# Altium schematic sheet Stimulation Stage.SchDoc
size E; SheetNumber: 1; SheetTotal: 1
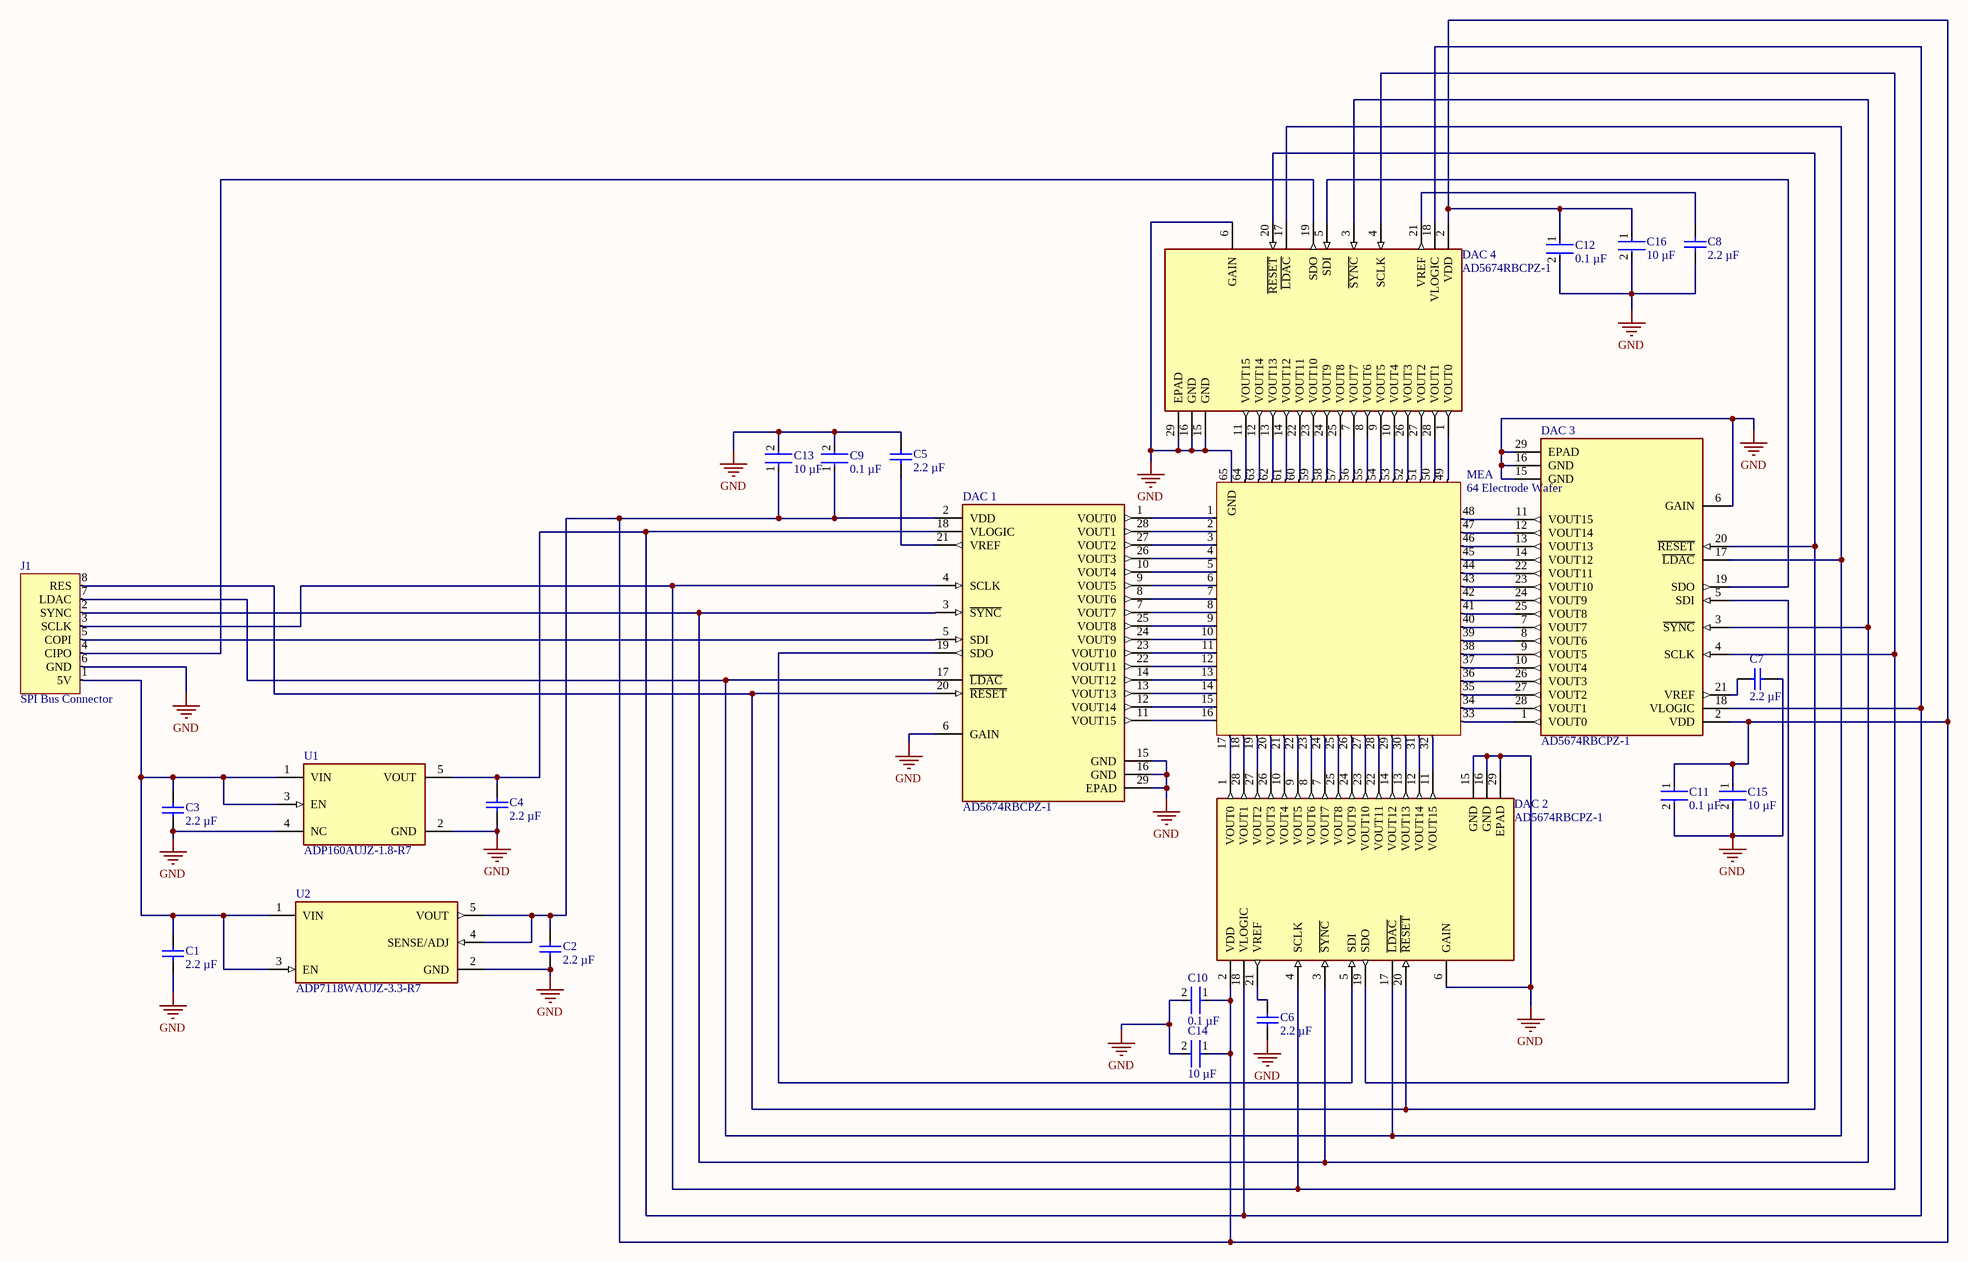
[diagram p0: Stimulation Stage.SchDoc]

## Parts
C1  2.2 µF  [CAPC1608X90X30LL10T20]
C2  2.2 µF  [CAPC1608X90X30LL10T20]
C3  2.2 µF  [CAPC1608X90X30LL10T20]
C4  2.2 µF  [CAPC1608X90X30LL10T20]
C5  2.2 µF  [CAPC1608X90X30LL10T20]
C6  2.2 µF  [CAPC1608X90X30LL10T20]
C7  2.2 µF  [CAPC1608X90X30LL10T20]
C8  2.2 µF  [CAPC1608X90X30LL10T20]
C9  0.1 µF  [FP-CL278-IPC_C]
C10  0.1 µF  [FP-CL278-IPC_C]
C11  0.1 µF  [FP-CL278-IPC_C]
C12  0.1 µF  [FP-CL278-IPC_C]
C13  10 µF  [FP-CL10-IPC_C]
C14  10 µF  [FP-CL10-IPC_C]
C15  10 µF  [FP-CL10-IPC_C]
C16  10 µF  [FP-CL10-IPC_C]
DAC_1  AD5674RBCPZ-1  [FP-CP-28-9-IPC_C]
DAC_2  AD5674RBCPZ-1  [FP-CP-28-9-IPC_C]
DAC_3  AD5674RBCPZ-1  [FP-CP-28-9-IPC_C]
DAC_4  AD5674RBCPZ-1  [FP-CP-28-9-IPC_C]
J1  SPI Bus Connector  [SPI Bus Connector]
MEA  64 Electrode Wafer  [64 Electrode Wafer Footprint]
U1  ADP160AUJZ-1.8-R7  [FP-UJ-5-IPC_C]
U2  ADP7118WAUJZ-3.3-R7  [FP-UJ-5-IPC_C]

## Nets
GND: C1.1 C2.1 C3.1 C4.1 C5.2 C6.1 C7.1 C8.1 C9.2 C10.2 C11.2 C12.2 C13.2 C14.2 C15.2 C16.2 DAC_1.6(GAIN) DAC_1.15(GND) DAC_1.16(GND) DAC_1.29(EPAD) DAC_2.6(GAIN) DAC_2.15(GND) DAC_2.16(GND) DAC_2.29(EPAD) DAC_3.6(GAIN) DAC_3.15(GND) DAC_3.16(GND) DAC_3.29(EPAD) DAC_4.6(GAIN) DAC_4.15(GND) DAC_4.16(GND) DAC_4.29(EPAD) J1.6(GND) MEA.65(GND) U1.2(GND) U1.4(NC) U2.2(GND)
NetC1_2: C1.2 C3.2 J1.1(5V) U1.1(VIN) U1.3(EN) U2.1(VIN) U2.3(EN)
NetC2_2: C2.2 C9.1 C10.1 C11.1 C12.1 C13.1 C14.1 C15.1 C16.1 DAC_1.2(VDD) DAC_2.2(VDD) DAC_3.2(VDD) DAC_4.2(VDD) U2.4(SENSE/ADJ) U2.5(VOUT)
NetC4_2: C4.2 DAC_1.18(VLOGIC) DAC_2.18(VLOGIC) DAC_3.18(VLOGIC) DAC_4.18(VLOGIC) U1.5(VOUT)
NetC5_1: C5.1 DAC_1.21(VREF)
NetC6_2: C6.2 DAC_2.21(VREF)
NetC7_2: C7.2 DAC_3.21(VREF)
NetC8_2: C8.2 DAC_4.21(VREF)
NetDAC_1_1: DAC_1.1(VOUT0) MEA.1
NetDAC_1_3: DAC_1.3(~{SYNC}) DAC_2.3(~{SYNC}) DAC_3.3(~{SYNC}) DAC_4.3(~{SYNC}) J1.2(SYNC)
NetDAC_1_4: DAC_1.4(SCLK) DAC_2.4(SCLK) DAC_3.4(SCLK) DAC_4.4(SCLK) J1.3(SCLK)
NetDAC_1_5: DAC_1.5(SDI) J1.5(COPI)
NetDAC_1_7: DAC_1.7(VOUT7) MEA.8
NetDAC_1_8: DAC_1.8(VOUT6) MEA.7
NetDAC_1_9: DAC_1.9(VOUT5) MEA.6
NetDAC_1_10: DAC_1.10(VOUT4) MEA.5
NetDAC_1_11: DAC_1.11(VOUT15) MEA.16
NetDAC_1_12: DAC_1.12(VOUT14) MEA.15
NetDAC_1_13: DAC_1.13(VOUT13) MEA.14
NetDAC_1_14: DAC_1.14(VOUT12) MEA.13
NetDAC_1_17: DAC_1.17(~{LDAC}) DAC_2.17(~{LDAC}) DAC_3.17(~{LDAC}) DAC_4.17(~{LDAC}) J1.7(LDAC)
NetDAC_1_19: DAC_1.19(SDO) DAC_2.5(SDI)
NetDAC_1_20: DAC_1.20(~{RESET}) DAC_2.20(~{RESET}) DAC_3.20(~{RESET}) DAC_4.20(~{RESET}) J1.8(RES)
NetDAC_1_22: DAC_1.22(VOUT11) MEA.12
NetDAC_1_23: DAC_1.23(VOUT10) MEA.11
NetDAC_1_24: DAC_1.24(VOUT9) MEA.10
NetDAC_1_25: DAC_1.25(VOUT8) MEA.9
NetDAC_1_26: DAC_1.26(VOUT3) MEA.4
NetDAC_1_27: DAC_1.27(VOUT2) MEA.3
NetDAC_1_28: DAC_1.28(VOUT1) MEA.2
NetDAC_2_1: DAC_2.1(VOUT0) MEA.17
NetDAC_2_7: DAC_2.7(VOUT7) MEA.24
NetDAC_2_8: DAC_2.8(VOUT6) MEA.23
NetDAC_2_9: DAC_2.9(VOUT5) MEA.22
NetDAC_2_10: DAC_2.10(VOUT4) MEA.21
NetDAC_2_11: DAC_2.11(VOUT15) MEA.32
NetDAC_2_12: DAC_2.12(VOUT14) MEA.31
NetDAC_2_13: DAC_2.13(VOUT13) MEA.30
NetDAC_2_14: DAC_2.14(VOUT12) MEA.29
NetDAC_2_19: DAC_2.19(SDO) DAC_3.5(SDI)
NetDAC_2_22: DAC_2.22(VOUT11) MEA.28
NetDAC_2_23: DAC_2.23(VOUT10) MEA.27
NetDAC_2_24: DAC_2.24(VOUT9) MEA.26
NetDAC_2_25: DAC_2.25(VOUT8) MEA.25
NetDAC_2_26: DAC_2.26(VOUT3) MEA.20
NetDAC_2_27: DAC_2.27(VOUT2) MEA.19
NetDAC_2_28: DAC_2.28(VOUT1) MEA.18
NetDAC_3_1: DAC_3.1(VOUT0) MEA.33
NetDAC_3_7: DAC_3.7(VOUT7) MEA.40
NetDAC_3_8: DAC_3.8(VOUT6) MEA.39
NetDAC_3_9: DAC_3.9(VOUT5) MEA.38
NetDAC_3_10: DAC_3.10(VOUT4) MEA.37
NetDAC_3_11: DAC_3.11(VOUT15) MEA.48
NetDAC_3_12: DAC_3.12(VOUT14) MEA.47
NetDAC_3_13: DAC_3.13(VOUT13) MEA.46
NetDAC_3_14: DAC_3.14(VOUT12) MEA.45
NetDAC_3_19: DAC_3.19(SDO) DAC_4.5(SDI)
NetDAC_3_22: DAC_3.22(VOUT11) MEA.44
NetDAC_3_23: DAC_3.23(VOUT10) MEA.43
NetDAC_3_24: DAC_3.24(VOUT9) MEA.42
NetDAC_3_25: DAC_3.25(VOUT8) MEA.41
NetDAC_3_26: DAC_3.26(VOUT3) MEA.36
NetDAC_3_27: DAC_3.27(VOUT2) MEA.35
NetDAC_3_28: DAC_3.28(VOUT1) MEA.34
NetDAC_4_1: DAC_4.1(VOUT0) MEA.49
NetDAC_4_7: DAC_4.7(VOUT7) MEA.56
NetDAC_4_8: DAC_4.8(VOUT6) MEA.55
NetDAC_4_9: DAC_4.9(VOUT5) MEA.54
NetDAC_4_10: DAC_4.10(VOUT4) MEA.53
NetDAC_4_11: DAC_4.11(VOUT15) MEA.64
NetDAC_4_12: DAC_4.12(VOUT14) MEA.63
NetDAC_4_13: DAC_4.13(VOUT13) MEA.62
NetDAC_4_14: DAC_4.14(VOUT12) MEA.61
NetDAC_4_19: DAC_4.19(SDO) J1.4(CIPO)
NetDAC_4_22: DAC_4.22(VOUT11) MEA.60
NetDAC_4_23: DAC_4.23(VOUT10) MEA.59
NetDAC_4_24: DAC_4.24(VOUT9) MEA.58
NetDAC_4_25: DAC_4.25(VOUT8) MEA.57
NetDAC_4_26: DAC_4.26(VOUT3) MEA.52
NetDAC_4_27: DAC_4.27(VOUT2) MEA.51
NetDAC_4_28: DAC_4.28(VOUT1) MEA.50

## Library data of the parts
C1-C8 = CMP-2000-06090-1: Chip Capacitor, 2.2 uF, +/- 10%, 10 V, -55 to 85 degC, 0603 (1608 Metric), RoHS, Tape and Reel; Manufacturer: Samsung Electro-Mechanics; Dielectric: X5R; Capacitance: 4700000pF; Rated Voltage: 6.3V; Manufacturer URL: http://www.samsungsem.com/global/index.jsp; Case Size/Dimension: 0603; Package Description: 2-Pin Surface Mount Device, Body 1.60 x 0.80 mm; Datasheet Version: 07/2016; Datasheet URL: http://www.samsungsem.com/kr/support/product-search/mlcc/__icsFiles/afieldfile/2016/08/18/S_CL10A475KQ8NNNC.pdf; Tolerance (%): ±10%; Mounting Technology: SurfaceMount; Package Reference: 0603
C9-C12 = CMP-13271-000728-1: Cap Ceramic 100nF 25V X5R ±10% SMD 0402 +85°C Paper T/R; Package Quantity: 1; Height: 0.5mm; Case Code (Metric): 1005; Thickness: 0.022inch; Mount: Surface Mount; Lead Free: Lead Free; Case Code (Imperial): 0402; Packaging: Tape and Reel; Depth: 0.5mm; Voltage: 25V; Min Operating Temperature: -55°C; Voltage Rating: 25V; Dielectric: X5R; Case/Package: 0402; Tolerance: 10%; Width: 0.02inch; Max Operating Temperature: 85°C; Capacitance: 100nF; Length: 1mm; Radiation Hardening: No; Voltage Rating (DC): 25V
C13-C16 = CMP-13271-001938-1: Cap Ceramic 10uF 6.3V X5R ±20% Pad SMD 0603 +85°C T/R; Contact Plating: Tin; Height: 0.8mm; Width: 0.031inch; Min Operating Temperature: -55°C; Capacitance: 10uF; Dielectric: X5R; Voltage Rating: 6.3V; Case/Package: 0603; Package Quantity: 1; Radiation Hardening: No; Packaging: Tape and Reel; Max Operating Temperature: 85°C; Voltage: 6.3V; Thickness: 0.035inch; Mount: Surface Mount; Case Code (Imperial): 0603; Case Code (Metric): 1608; Depth: 0.8mm; Tolerance: 20%; Length: 1.6mm
DAC_1-DAC_4 = CMP-09082-000013-1: 16-CH12-BITNANODAC+WITH2PPM/CREF; RoHS Compliant: Yes
J1 = SPI Bus Connector: 8 pin connector for SPI interface and power from m; Part Number: SPI Bus Connector
MEA = 64 Electrode Wafer: 64 channel transparent Microelectrode Array; Part Number: 64 Electrode Wafer
U1 = CMP-09138-000088-1: IC REG LINEAR 1.8V 150MA TSOT5; Power Supply Rejection Ratio (PSRR): 60dB; Polarity: Positive; Min Output Voltage: 1.2V; Quiescent Current: 0mA; Number of Regulators: 1; Min Current Limit: 220mA; Max Input Voltage: 5.5V; Max Supply Current: 42uA; Max Output Voltage: 4.2V; Output Voltage Accuracy: 2%; Dropout Voltage: 120mV; Min Input Voltage: 2.2V; Output Type: Fixed; Length: 2.9mm; Width: 1.6mm; Height: 0.9mm; Case/Package: TSOT; Min Operating Temperature: -40°C; Number of Outputs: 1; Contact Plating: Tin; Radiation Hardening: No; Lead Free: Contains Lead; Mount: Surface Mount; Output Voltage: 1.8V; Max Output Current: 150mA; Operating Supply Current: 42uA; Nominal Output Voltage: 1.8V; Packaging: Tape and Reel; Accuracy: 2%; Nominal Supply Current: 42uA; Output Current: 150mA; Number of Pins: 5; Max Operating Temperature: 125°C; Series: -; RoHS Compliant: Yes
U2 = CMP-09138-000103-1: IC REG LINEAR 3.3V 200MA TSOT5